# Altium schematic sheet Starboard_Headers.SchDoc: Starboard_Headers
size Letter; Author: Nicholas J. Sorensen, and Erik F. Halliwell; Engineer: Nicholas J. Sorensen, and Erik F. HalliwellNicholas Sorensen, and Erik Halliwell; DocumentNumber: 8; SheetNumber: 8; SheetTotal: 8
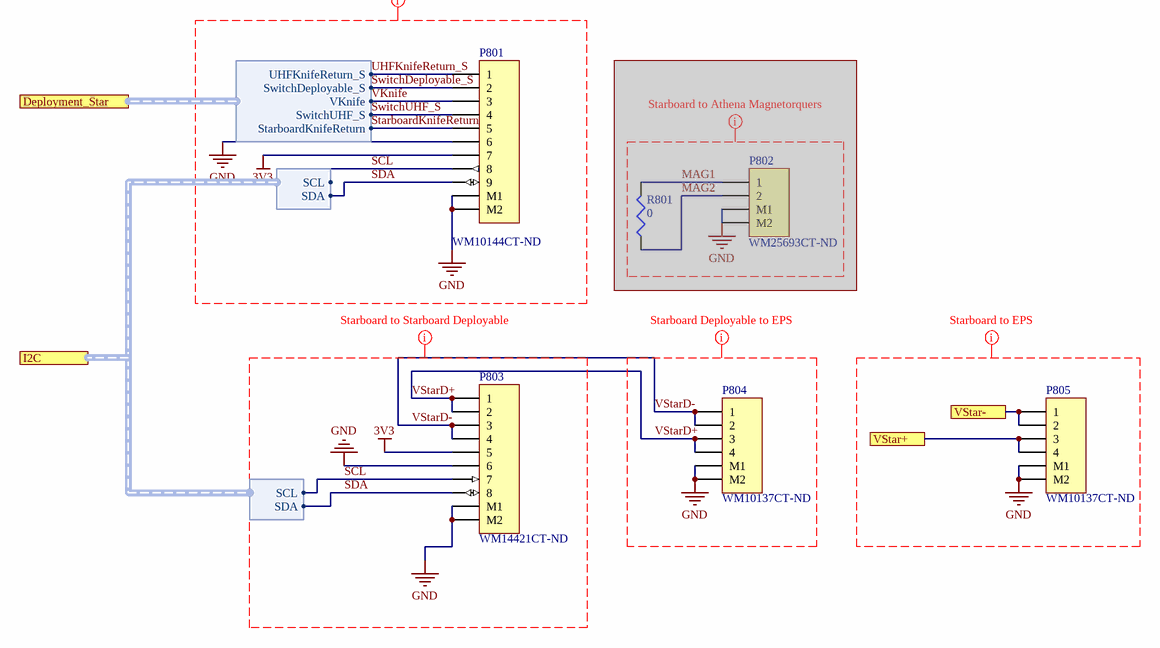
[diagram p0: Starboard_Headers.SchDoc]

## Parts
P801  WM10144CT-ND  [MOLX-5040500991]
P802  WM25693CT-ND  [MOLX-5040500291]  (masked out: inside a compile mask, not in the netlist)
P803  WM14421CT-ND  [MOLX-5040500891]
P804  WM10137CT-ND  [MOLX-5040500491]
P805  WM10137CT-ND  [MOLX-5040500491]
R801  value 0  [VSH-0805MCU]  (hidden comment: Res3)  (masked out: inside a compile mask, not in the netlist)

## Ports
Deployment_Star (harness Deployment_Star), I2C (harness I2C), VStar+, VStar-

## Harnesses
Deployment_Star: UHFKnifeReturn_S, SwitchDeployable_S, VKnife, StarboardKnifeReturn, SwitchUHF_S
I2C: SCL, SDA

## Nets
3V3: P801.7 P803.5
GND: P801.6 P801.M1 P801.M2 P803.6 P803.M1 P803.M2 P804.M1 P804.M2 P805.M1 P805.M2
SCL: P801.8 P803.7 ; port I2C.SCL
SDA: P801.9 P803.8 ; port I2C.SDA
StarboardKnifeReturn: P801.5 ; port Deployment_Star.StarboardKnifeReturn
SwitchDeployable_S: P801.2 ; port Deployment_Star.SwitchDeployable_S
SwitchUHF_S: P801.4 ; port Deployment_Star.SwitchUHF_S
UHFKnifeReturn_S: P801.1 ; port Deployment_Star.UHFKnifeReturn_S
VKnife: P801.3 ; port Deployment_Star.VKnife
VStar+: P805.3 P805.4 ; port VStar+
VStar-: P805.1 P805.2 ; port VStar-
VStarD+: P803.1 P803.2 P804.3 P804.4
VStarD-: P803.3 P803.4 P804.1 P804.2

## Layout directives
mark named Starboard Deployable to EPS: GND, VStarD+, VStarD-
mark named Starboard to EPS: GND
mark named Starboard to Athena Magnetorquers: GND, MAG1, MAG2
mark named Starboard to Starboard Deployable: VStarD-
mark named Starboard to Athena Burnwires/I2C: 3V3, GND, SCL, SDA, StarboardKnifeReturn, SwitchDeployable_S, SwitchUHF_S, UHFKnifeReturn_S, VKnife

## Notes on the sheet
- (the "License"); you may not use or redistribute this file except in compliance with the License. You
- This file and the information within it are licensed under the terms of the Apache License, Version 2.0
- Copyright
- Unless required by applicable law or agreed to in writing, content distributed under the License is
- distributed on an "AS IS" BASIS, WITHOUT WARRANTIES OR CONDITIONS OF ANY KIND,
- either express or implied. See the License for the specific language governing permissions and
- limitations under the License.
- may obtain a copy of the License at:
- http://www.apache.org/licenses/LICENSE-2.0
- Title
- Size:
- Date:
- Letter
- Number:
- Time:
- Revision:
- Sheet
- of
- University of Alberta
- Deptartment of Electrical
- and Computer Engineering
- Edmonton AB, Canada
- T6G 1H9
- File:

## Library data of the parts
P801 = 68: CONN HEADER SMD R/A 9POS 1.5MM; Part Number: 68; Manufacturer Part Number: 5040500991; Designator: P?; LatestRevisionDate: 17-Jul-2002; LatestRevisionNote: Re-released for DXP Platform.; Publisher: Altium Limited; Supplier Part Number 1: WM25695CT-ND; Supplier 1: Digi-Key; Supplier Link: #https://www.digikey.ca/product-detail/en/molex/5040500991/WM25695CT-ND/9954121#
P802 = 61: CONN HEADER SMD R/A 2POS 1.5MM; Part Number: 61; Manufacturer Part Number: 5040500291; Designator: P?; LatestRevisionDate: 17-Jul-2002; LatestRevisionNote: Re-released for DXP Platform.; Publisher: Altium Limited; Supplier Part Number 1: WM25693CT-ND; Supplier 1: Digi-Key; Supplier Link: #https://www.digikey.ca/product-detail/en/molex/5040500291/WM25693CT-ND/9954119#
P803 = 67: CONN HEADER SMD R/A 8POS 1.5MM; Part Number: 67; Manufacturer Part Number: 5040500891; Designator: P?; LatestRevisionDate: 17-Jul-2002; LatestRevisionNote: Re-released for DXP Platform.; Publisher: Altium Limited; Supplier Part Number 1: WM14421CT-ND; Supplier 1: Digi-Key; Supplier Link: #https://www.digikey.ca/product-detail/en/molex/5040500891/WM14421CT-ND/6133151#
P804 P805 = 63: CONN HEADER SMD R/A 4POS 1.5MM; Part Number: 63; Manufacturer Part Number: 5040500491; Designator: P?; LatestRevisionDate: 17-Jul-2002; LatestRevisionNote: Re-released for DXP Platform.; Publisher: Altium Limited; Supplier Part Number 1: WM10137CT-ND; Supplier 1: Digi-Key; Supplier Link: #https://www.digikey.ca/product-detail/en/molex/5040500491/WM10137CT-ND/4357653#
R801 = PR-VSH-00003: RES SMD 0.0 OHM JUMPER 1/5W 0805; Manufacturer Part Number: MCU08050Z0000ZP500; Index: 3; Designator: R?; Published: 3/14/2016; LatestRevisionDate: 3/14/2016; LatestRevisionNote: ...; PackageReference: 0805 (2012 Metric); Publisher: AlbertaSat; PackageDescription: Chip Resistor, 2-Leads, Body 2.00x1.25mm, IPC Low Density; Part Number: PR-VSH-00003; Supplier Part Number 1: MCU0805-0.0-ZZCT-ND; Supplier 1: Digi-key; Supplier Link: http://www.digikey.ca/product-search/en?keywords=MCU0805-0.0-ZZCT-ND; Tolerance: Jumper; Power - Rated: 1/5W; Temperature Coefficient: -; Applications: General Purpose